# Altium schematic sheet Power.SchDoc
size A3
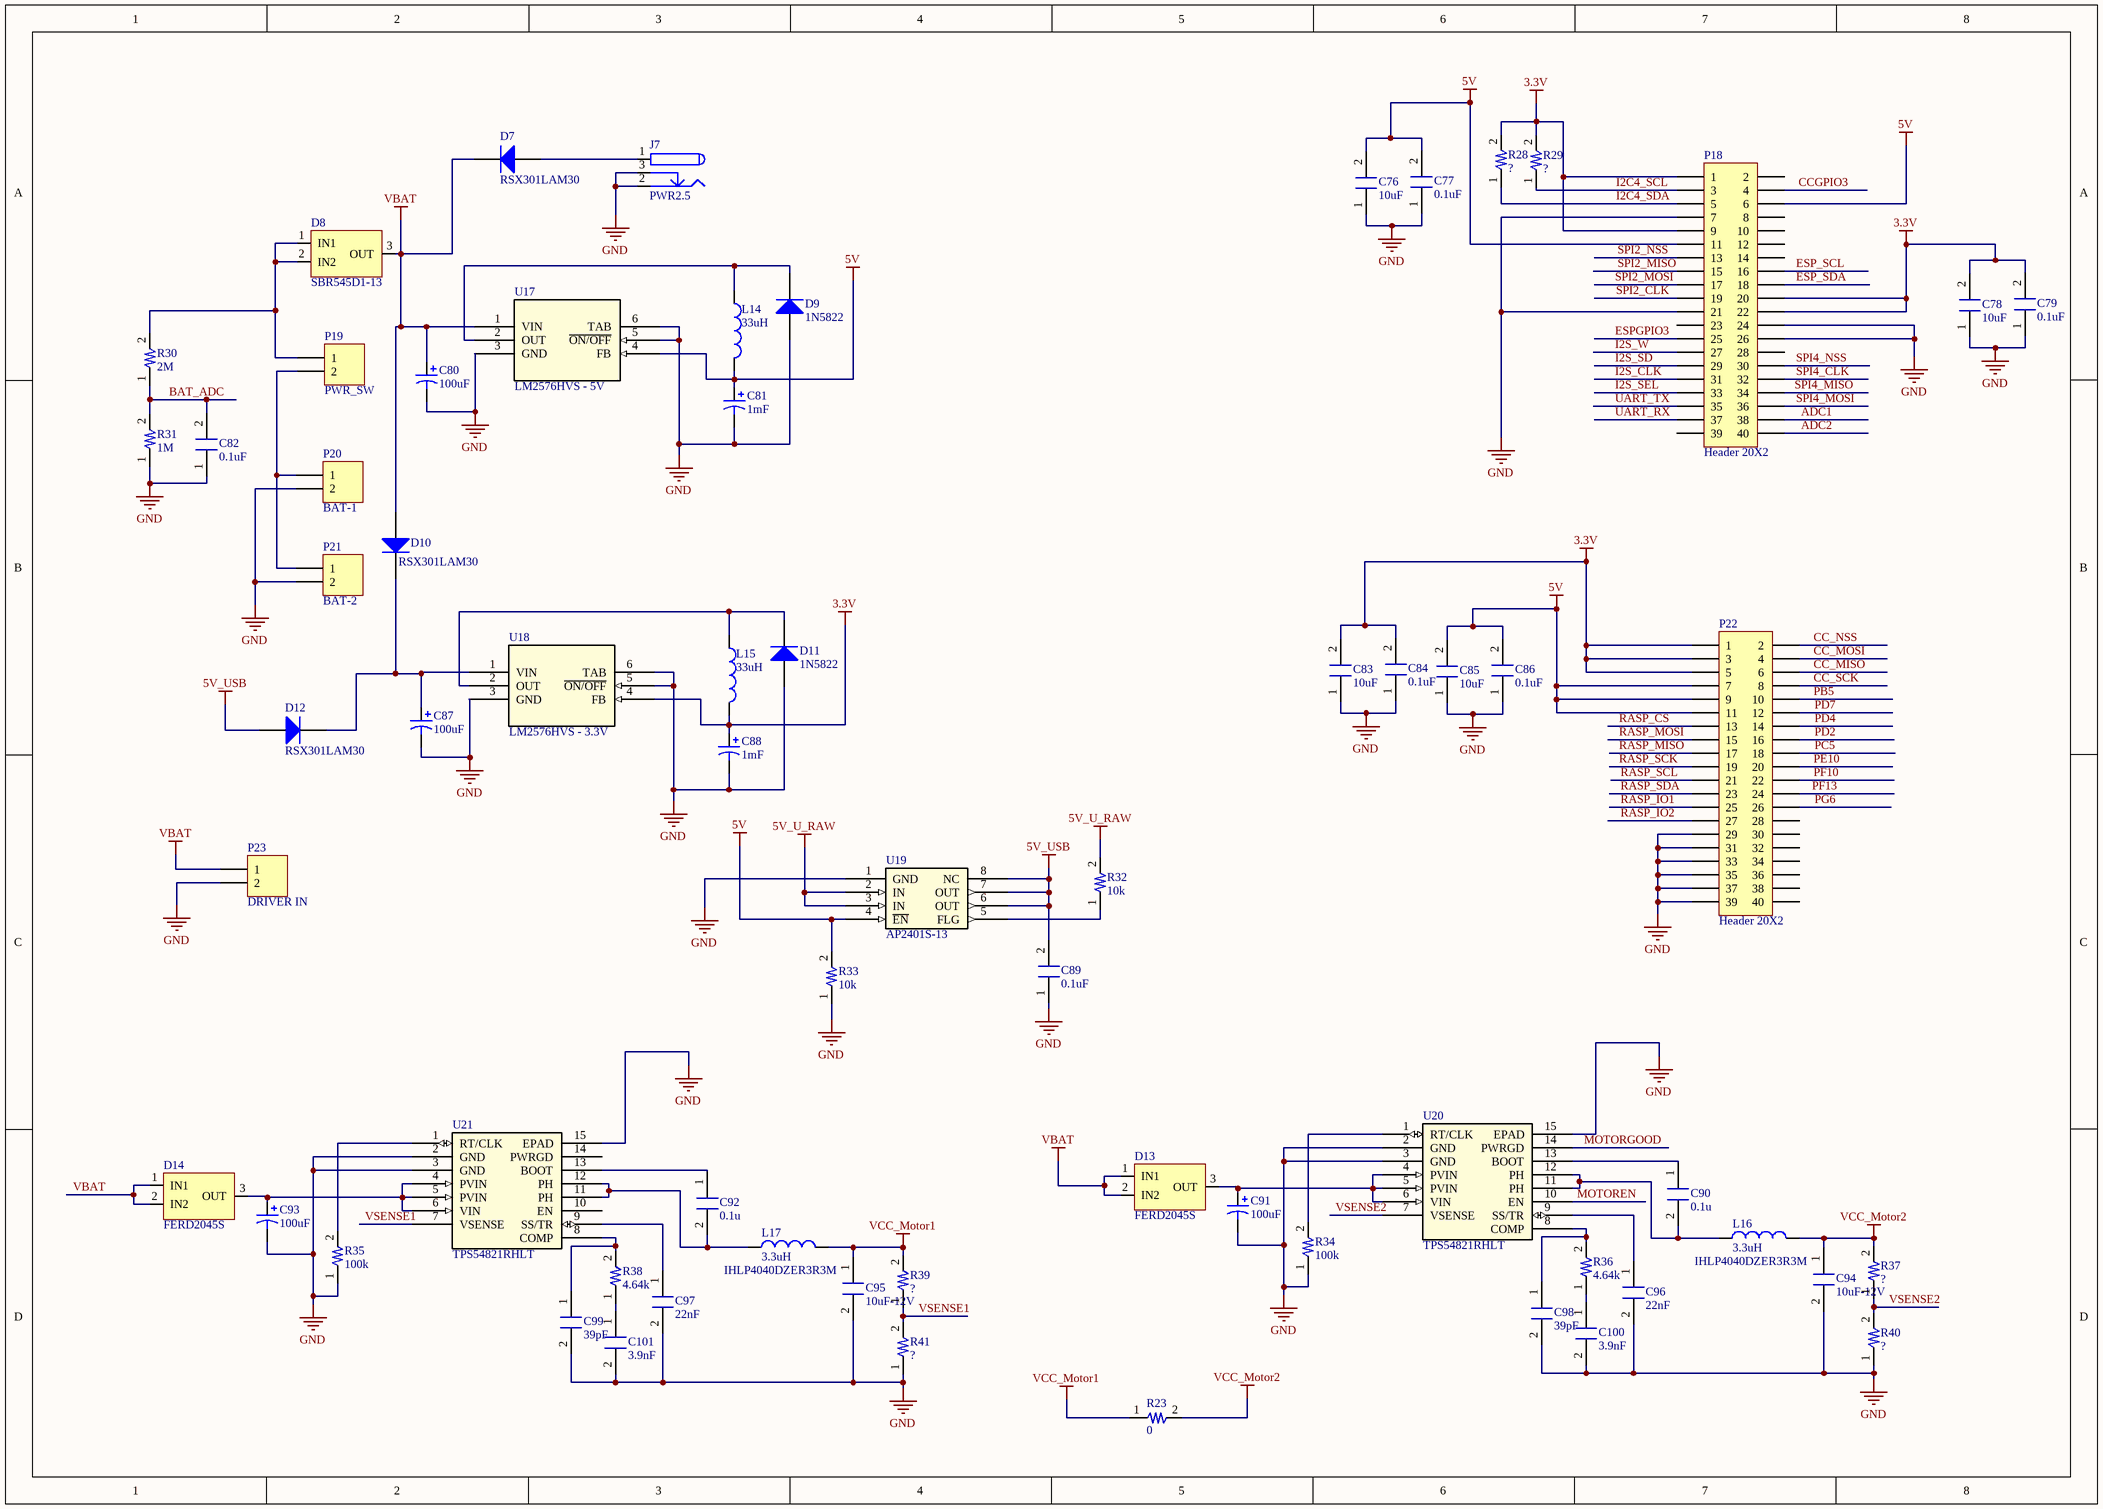
[diagram p0: Power.SchDoc]

## Parts
C76  value 10uF  [Capacitor 0603]  (hidden comment: Ceramic Capacitor)
C77  value 0.1uF  [Capacitor 0402]  (hidden comment: Ceramic Capacitor)
C78  value 10uF  [Capacitor 0603]  (hidden comment: Ceramic Capacitor)
C79  value 0.1uF  [Capacitor 0402]  (hidden comment: Ceramic Capacitor)
C80  100uF  [CAPE5.0mm]
C81  1mF  [CAPE5.0mm]
C82  value 0.1uF  [Capacitor 0402]  (hidden comment: Ceramic Capacitor)
C83  value 10uF  [Capacitor 0603]  (hidden comment: Ceramic Capacitor)
C84  value 0.1uF  [Capacitor 0402]  (hidden comment: Ceramic Capacitor)
C85  value 10uF  [Capacitor 0603]  (hidden comment: Ceramic Capacitor)
C86  value 0.1uF  [Capacitor 0402]  (hidden comment: Ceramic Capacitor)
C87  100uF  [CAPE5.0mm]
C88  1mF  [CAPE5.0mm]
C89  value 0.1uF  [Capacitor 0402]  (hidden comment: Ceramic Capacitor)
C90  value 0.1u  [Capacitor 0603]  (hidden comment: Ceramic Capacitor)
C91  100uF  [CAPE5.0mm]
C92  value 0.1u  [Capacitor 0603]  (hidden comment: Ceramic Capacitor)
C93  100uF  [CAPE5.0mm]
C94  value 10uF-12V  [CAPAE250P680X1220_VERT]  (hidden comment: Ceramic Capacitor)
C95  value 10uF-12V  [CAPAE250P680X1220_VERT]  (hidden comment: Ceramic Capacitor)
C96  value 22nF  [Capacitor 0402]  (hidden comment: Ceramic Capacitor)
C97  value 22nF  [Capacitor 0402]  (hidden comment: Ceramic Capacitor)
C98  value 39pF  [Capacitor 0402]  (hidden comment: Ceramic Capacitor)
C99  value 39pF  [Capacitor 0402]  (hidden comment: Ceramic Capacitor)
C100  value 3.9nF  [Capacitor 0402]  (hidden comment: Ceramic Capacitor)
C101  value 3.9nF  [Capacitor 0402]  (hidden comment: Ceramic Capacitor)
D7  RSX301LAM30  [SOD128]
D8  SBR545D1-13  [TO-252]
D9  1N5822  [DO-201AD]
D10  RSX301LAM30  [SOD128]
D11  1N5822  [DO-201AD]
D12  RSX301LAM30  [SOD128]
D13  FERD2045S  [DPAK]
D14  FERD2045S  [DPAK]
J7  PWR2.5  [KLD-0202]
L14  value 33uH  [IND Coil]  (hidden comment: Inductor)
L15  value 33uH  [IND Coil]  (hidden comment: Inductor)
L16  IHLP4040DZER3R3M  value 3.3uH  [IND_IHLP-4040DZ-]
L17  IHLP4040DZER3R3M  value 3.3uH  [IND_IHLP-4040DZ-]
P18  Header 20X2  [HDR2X20]
P19  PWR_SW  [HDR1X2]
P20  BAT-1  [BAT]
P21  BAT-2  [HDR1X2]
P22  Header 20X2  [HDR2X20]
P23  DRIVER IN  [HDR1X2]
R23  value 0  [Resistor 0805]  (hidden comment: Resistor)
R28  Resistor  [Resistor 0402]  (value not drawn)
R29  Resistor  [Resistor 0402]  (value not drawn)
R30  value 2M  [Resistor 0402]  (hidden comment: Resistor)
R31  value 1M  [Resistor 0402]  (hidden comment: Resistor)
R32  value 10k  [Resistor 0402]  (hidden comment: Resistor)
R33  value 10k  [Resistor 0402]  (hidden comment: Resistor)
R34  value 100k  [Resistor 0402]  (hidden comment: Resistor)
R35  value 100k  [Resistor 0402]  (hidden comment: Resistor)
R36  value 4.64k  [Resistor 0402]  (hidden comment: Resistor)
R37  Resistor  [Resistor 0402]  (value not drawn)
R38  value 4.64k  [Resistor 0402]  (hidden comment: Resistor)
R39  Resistor  [Resistor 0402]  (value not drawn)
R40  Resistor  [Resistor 0402]  (value not drawn)
R41  Resistor  [Resistor 0402]  (value not drawn)
U17  LM2576HVS - 5V  [TS5B]
U18  LM2576HVS - 3.3V  [TS5B]
U19  AP2401S-13  [SO8]
U20  TPS54821RHLT  [RHL14_2P05X2P05]
U21  TPS54821RHLT  [RHL14_2P05X2P05]

## Nets
3.3V: C78.2 C79.2 C83.2 C84.2 C88.1 L15.2 P18.1 P18.9 P18.20 P18.22 P22.1 P22.3 P22.5 R28.2 R29.2 U18.4(FB)
5V: C76.2 C77.2 C81.1 C85.2 C86.2 L14.2 P18.6 P18.11 P22.7 P22.9 P22.11 R33.2 U17.4(FB) U19.4(~{EN})
5V_U_RAW: R32.2 U19.2(IN) U19.3(IN)
5V_USB: C89.2 D12.1(A) U19.6(OUT) U19.7(OUT) U19.8(NC)
GND: C76.1 C77.1 C78.1 C79.1 C80.2 C81.2 C82.1 C83.1 C84.1 C85.1 C86.1 C87.2 C88.2 C89.1 C91.2 C93.2 C94.2 C95.2 C96.2 C97.2 C98.2 C99.2 C100.2 C101.2 D9.1(A) D11.1(A) J7.2 J7.3 P18.7 P18.21 P18.24 P18.26 P20.2 P21.2 P22.29 P22.31 P22.33 P22.35 P22.37 P22.39 P23.2 R31.1 R33.1 R34.1 R35.1 R40.1 R41.1 U17.3(GND) U17.5(~{ON/OFF}) U17.6(TAB) U18.3(GND) U18.5(~{ON/OFF}) U18.6(TAB) U19.1(GND) U20.2(GND) U20.3(GND) U20.15(EPAD) U21.2(GND) U21.3(GND) U21.15(EPAD)
VBAT: C80.1 D7.2(K) D8.3(OUT) D10.1(A) D13.1(IN1) D13.2(IN2) D14.1(IN1) D14.2(IN2) P23.1 U17.1(VIN)
VCC_Motor1: C95.1 L17.2 R23.1 R39.2
VCC_Motor2: C94.1 L16.2 R23.2 R37.2
ADC1: P18.38
ADC2: P18.40
BAT_ADC: C82.2 R30.1 R31.2
CC_MISO: P22.6
CC_MOSI: P22.4
CC_NSS: P22.2
CC_SCK: P22.8
CCGPIO3: P18.4
ESP_SCL: P18.16
ESP_SDA: P18.18
ESPGPIO3: P18.25
I2C4_SCL: P18.3 R29.1
I2C4_SDA: P18.5 R28.1
I2S_CLK: P18.31
I2S_SD: P18.29
I2S_SEL: P18.33
I2S_W: P18.27
MOTOREN: U20.10(EN)
MOTORGOOD: U20.14(PWRGD)
PB5: P22.10
PC5: P22.18
PD2: P22.16
PD4: P22.14
PD7: P22.12
PE10: P22.20
PF10: P22.22
PF13: P22.24
PG6: P22.26
RASP_CS: P22.13
RASP_IO1: P22.25
RASP_IO2: P22.27
RASP_MISO: P22.17
RASP_MOSI: P22.15
RASP_SCK: P22.19
RASP_SCL: P22.21
RASP_SDA: P22.23
SPI2_CLK: P18.19
SPI2_MISO: P18.15
SPI2_MOSI: P18.17
SPI2_NSS: P18.13
SPI4_CLK: P18.32
SPI4_MISO: P18.34
SPI4_MOSI: P18.36
SPI4_NSS: P18.30
UART_RX: P18.37
UART_TX: P18.35
VSENSE1: R39.1 R41.2 U21.7(VSENSE)
VSENSE2: R37.1 R40.2 U20.7(VSENSE)
NetC87_1: C87.1 D10.2(K) D12.2(K) U18.1(VIN)
NetC90_1: C90.1 U20.13(BOOT)
NetC90_2: C90.2 L16.1 U20.11(PH) U20.12(PH)
NetC91_1: C91.1 D13.3(OUT) U20.4(PVIN) U20.5(PVIN) U20.6(VIN)
NetC92_1: C92.1 U21.13(BOOT)
NetC92_2: C92.2 L17.1 U21.11(PH) U21.12(PH)
NetC93_1: C93.1 D14.3(OUT) U21.4(PVIN) U21.5(PVIN) U21.6(VIN)
NetC96_1: C96.1 U20.9(SS/TR)
NetC97_1: C97.1 U21.9(SS/TR)
NetC98_1: C98.1 R36.2 U20.8(COMP)
NetC99_1: C99.1 R38.2 U21.8(COMP)
NetC100_1: C100.1 R36.1
NetC101_1: C101.1 R38.1
NetD7_1: D7.1(A) J7.1
NetD8_1: D8.1(IN1) D8.2(IN2) P19.1 R30.2
NetD9_2: D9.2(K) L14.1 U17.2(OUT)
NetD11_2: D11.2(K) L15.1 U18.2(OUT)
NetP19_2: P19.2 P20.1 P21.1
NetR32_1: R32.1 U19.5(FLG)
NetR34_2: R34.2 U20.1(RT/CLK)
NetR35_2: R35.2 U21.1(RT/CLK)

Not connected (* = marked no-connect by the designer): P18 2 8 10 12 14 23 28 39; P22 28 30 32 34 36 38 40; U21 10(EN) 14(PWRGD)

## Library data of the parts
C80 C81 C87 C88 C91 C93 = Cap Pol1: Polarized Capacitor (Radial); Published: 8-Jun-2000; LatestRevisionDate: 17-Jul-2002; LatestRevisionNote: Re-released for DXP Platform.; PackageReference: RB7.6-15; Publisher: Altium Limited; PackageDescription: Polarized Capacitor (Radial); 2 Leads
D7 D9-D12 = Diode 1N5401: 3 Amp General Purpose Rectifier; Published: 8-Jun-2000; LatestRevisionDate: 17-Jul-2002; LatestRevisionNote: Re-released for DXP Platform.; DatasheetVersion: 1998; PackageVersion: Aug-1999; PackageReference: DO-201AD; Publisher: Altium Limited; PackageDescription: Diode, Axial; Body 9.5 x 5.6 mm (LxDia. max), Lead Dia. 1.32 mm (max); ComponentLink1Description: Manufacturer Link; ComponentLink1URL: http://www.fairchildsemi.com/; ComponentLink2Description: Datasheet; ComponentLink2URL: http://www.fairchildsemi.com/ds/1N%2F1N5400.pdf
D8 = Diode Array: pin to pad: 2>3 3>4
D13 D14 = Diode Array
J7 = PWR2.5: Low Voltage Power Supply Connector; Published: 17-Dec-2003; DatasheetDocument: 09-May-2002; Publisher: Altium Limited; ComponentLink1Description: Manufacturer Link; ComponentLink1URL: http://domino.kycon.com/internet/Products.html
L14 L15 = Inductor: Code_IEC: 1005; Published: 8-Jun-2000; LatestRevisionDate: 29-May-2009; LatestRevisionNote: IPC-7351 Footprint Added.; PackageReference: 0402-A; Publisher: Altium Limited; PackageDescription: Chip Inductor; Code_JEITA: 0402
L16 L17 = Inductor
P18 P22 = Header 20X2: Header, 20-Pin, Dual row; LatestRevisionDate: 17-Jul-2002; LatestRevisionNote: Re-released for DXP Platform.; Publisher: Altium Limited
P19-P21 P23 = Header 2: Header, 2-Pin; LatestRevisionDate: 17-Jul-2002; LatestRevisionNote: Re-released for DXP Platform.; Publisher: Altium Limited
R23 R28-R41 = Resistor: General Purpose Resistor; Digikey: *
  R28 R29 R37 R39-R41: Value: ?
U17 U18 = LM2576HVS: No Description Available
U19 = AP2401S-13: No Description Available; Vendor: Diodes Inc; Built_By: EMA_UL_Team; Manufacturer_Part_Number: AP2401S-13; Copyright: Copyright (C) 2018 Accelerated Designs. All rights reserved; RefDes: RefDes; Type: DEV; Value: Value
U20 U21 = TPS54821RHLT: No Description Available
C76-C79 C82-C86 C89 C90 C92 C94-C101 = Ceramic Capacitor: Digikey: *